# Altium schematic sheet PSU_2V5_LDK130.SchDoc: PSU 2V5
size A4; DocumentNumber: 16; SheetNumber: 16; SheetTotal: 18
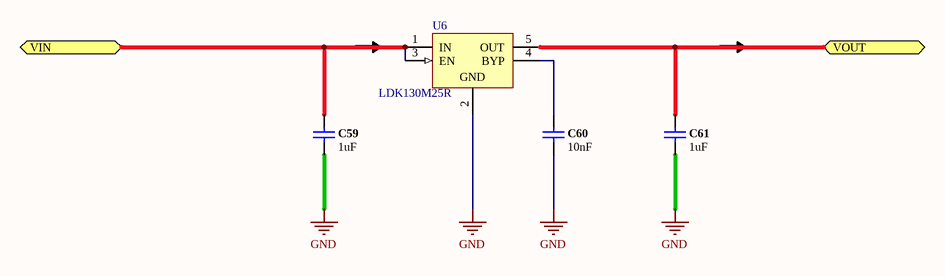
[diagram p0: PSU_2V5_LDK130.SchDoc]

## Parts
C59  1uF  [0805C-GENERIC]
C60  10nF  [0805C-GENERIC]
C61  1uF  [0805C-GENERIC]
U6  LDK130M25R  [SOT23-5L_N]

## Ports
VIN, VOUT

## Nets
GND: C59.2 C60.2 C61.2 U6.2(GND)
VIN: C59.1 U6.1(IN) U6.3(EN) ; port VIN
VOUT: C61.1 U6.5(OUT) ; port VOUT
NetC60_1: C60.1 U6.4(BYP)

## Notes on the sheet
- Title
- Size:
- Date:
- A4
- Number:
- Time:
- Revision:
- Sheet
- of
- File:

## Library data of the parts
C59-C61 = D-101-0027: Capacitor, Ceramic, 10% 10V 0805 X7R; Polarity: Non-Polarized; Dielectric: X7R; Mounting Technology: Surface Mount; Rated Voltage: 10 V; Status: Production; Technology: Ceramic; Tolerance: 10 %; Category: Capacitor
  C59 C61: Capacitance: 1uF
  C60: Capacitance: 10nF
U6 = LD2985BM25R: 300mA, Very-Low Drop and Low Noise Voltage Regulator Low ESR Capacitors Compatible, with Inhibit Function, 2.5V, 5-Pin SOT23-5L; PackageVersion: 2008; PackageReference: SOT23-5L; PackageDescription: 5-Pin SOT-23 Package, 2.9 x 1.6 mm Body, 0.95 mm Pitch, 2.8 mm Lead Span; PartNumber: LDK130M25R; ComponentLink1Description: Manufacturer URL; ComponentLink1URL: http://www.st.com